# Altium project PCB Potencia.PrjPcb
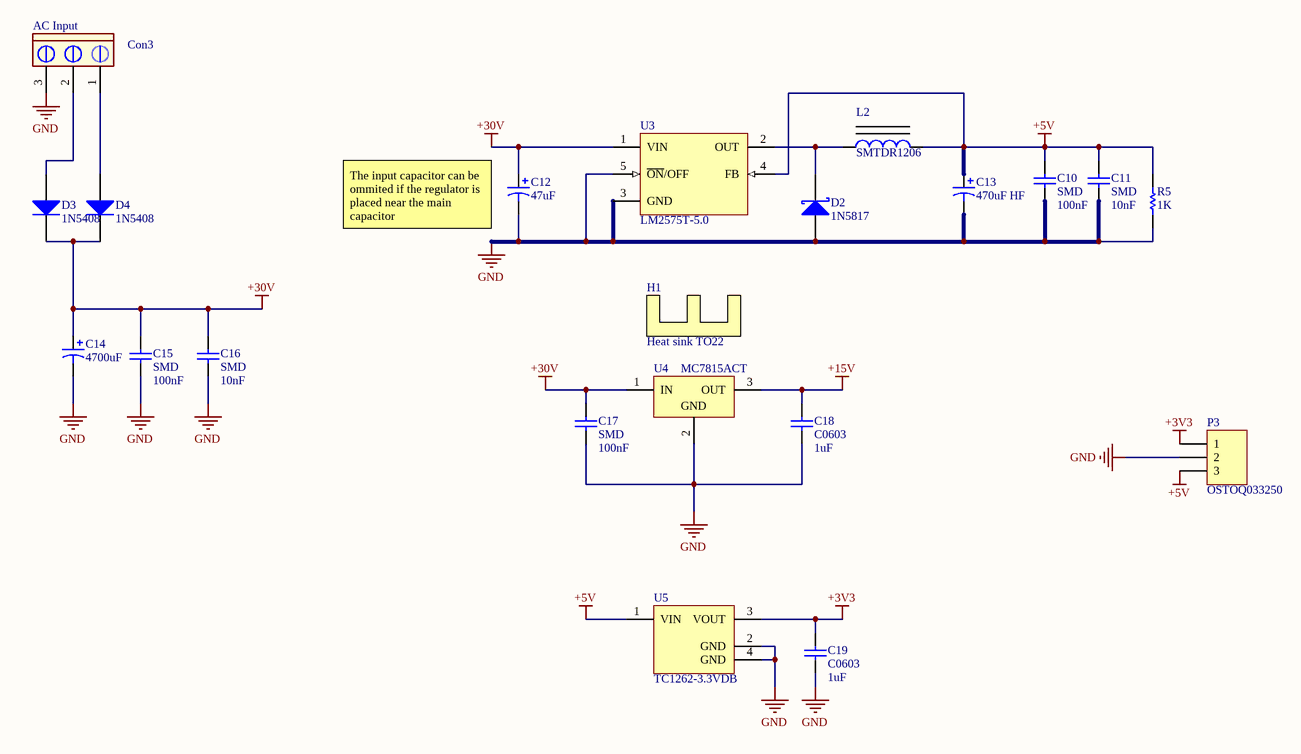
[diagram p0: Regulators.SchDoc]
5 sheets, 128 parts. Net scope: global (net labels, ports and power ports of the same name join across sheets).
Board file: Potencia.PcbDoc
Sheets:
  Regulators.SchDoc
  5V and 3V3 Outputs.SchDoc
  Variable Output 1.SchDoc
  Control.SchDoc
  Remote Feedback.SchDoc

## Sheet Regulators.SchDoc
size A4

### Parts
C10  SMD  value 100nF  [1206]
C11  SMD  value 10nF  [1206]
C12  47uF  [CAPPR2.5-6.3X11]
C13  470uF HF  [CAPPR5-10X20]
C14  value 4700uF  [Capacitor 23x48 (DxH)]  (hidden comment: Generic Electrolytic Capacitor)
C15  SMD  value 100nF  [1206]
C16  SMD  value 10nF  [1206]
C17  SMD  value 100nF  [1206]
C18  C0603  value 1uF  [0603]
C19  C0603  value 1uF  [0603]
Con3  AC Input  [My_CN3]
D2  1N5817  [DO-41]
D3  1N5408  [Vertical DO-201AD]
D4  1N5408  [Vertical DO-201AD]
H1  Heat sink TO22  [My_Heat_sink_TO22]
L2  SMTDR1206  [SMTDR1206 Inductor]
P3  XY2500R-F 3P  [OSTOQ033250]  (value not drawn)
R5  1K  [ERA-0603]
U3  LM2575T-5.0  [T05A]
U4  MC7815ACT  [221A-04]
U5  TC1262-3.3VDB  [SOT-223-DB3_N]

### Nets
+3V3: C19.2 P3.1 U5.3(VOUT)
+5V: C10.2 C11.2 C13.1 L2.2 P3.3 R5.2 U3.4(FB) U5.1(VIN)
+15V: C18.2 U4.3(OUT)
+30V: C12.1 C14.1 C15.2 C16.2 C17.2 D3.2(K) D4.2(K) U3.1(VIN) U4.1(IN)
GND: C10.1 C11.1 C12.2 C13.2 C14.2 C15.1 C16.1 C17.1 C18.1 C19.1 Con3.3 D2.1(A) P3.2 R5.1 U3.3(GND) U3.5(~{ON}/OFF) U4.2(GND) U5.2(GND) U5.4(GND)
NetCon3_1: Con3.1 D4.1(A)
NetCon3_2: Con3.2 D3.1(A)
NetD2_2: D2.2(K) L2.1 U3.2(OUT)

### Notes on the sheet
- (near C12) The input capacitor can be ommited if the regulator is placed near the main capacitor

### Library data of the parts
C10 C11 C15-C17 = C1206: Ceramic Chip Capacitor - Standard; Published: 17-Jul-2002; LatestRevisionDate: 19-Mar-2004; LatestRevisionNote: Silkscreen size reduced.; DatasheetDocument: Mar-2001; PackageDocument: Mar-2001; PackageReference: 1206; Publisher: Altium Limited; Code_JEITA: 1206; Code_IPC: 3216 [1206]; ComponentLink1Description: Manufacturer Link; ComponentLink1URL: http://www.kemet.com/; ComponentLink2Description: Datasheet; ComponentLink2URL: http://www.kemet.com/kemet/web/homepage/kechome.nsf/vapubfilesname/F3102TA.pdf/$file/F3102TA.pdf
C12 = EKE00BA247H00: Aluminum Electrolytic Capacitor, Radial Style with Long Leads: 47uF, 50V; Note: Refer to Manufacturer's Data Sheets for other lead formations; DrillSize: Nominal, Rounded To The Nearest 0.1mm; Published: 19-Mar-2004; DatasheetDocument: 30-May-2000; PackageReference: CAPPR2.5-6.3X11; Publisher: Altium Limited; ComponentLink1Description: Manufacturer Link; ComponentLink1URL: http://www.vishay.com/; ComponentLink2Description: Datasheet; ComponentLink2URL: http://www.vishay.com/docs/25008/eke.pdf; Value: 47uF
C13 = EKC00DE347E00: Aluminum Electrolytic Capacitor, Radial Style with Long Leads: 470uF, 25V; Note: Refer to Manufacturer's Data Sheets for other lead formations; DrillSize: Nominal, Rounded To The Nearest 0.1mm; Published: 19-Mar-2004; DatasheetDocument: 12-Jan-2000; PackageReference: CAPPR5-10X20; Publisher: Altium Limited; ComponentLink1Description: Manufacturer Link; ComponentLink1URL: http://www.vishay.com/; ComponentLink2Description: Datasheet; ComponentLink2URL: http://www.vishay.com/docs/25009/ekc.pdf; Value: 470uF
C18 C19 = C0603: C1608X7R1C105K X7R; Note: Footprint corresponds to dimensions for bulk cassette packaging. This case size has tightened tolerances.; Published: 17-Jul-2002; LatestRevisionDate: 19-Mar-2004; LatestRevisionNote: Silkscreen size reduced.; DatasheetDocument: Mar-2001; PackageDocument: Mar-2001; PackageReference: 0603; Publisher: Altium Limited; Code_JEITA: 0603; Code_IPC: 1608 [0603]; ComponentLink1Description: Manufacturer Link; ComponentLink1URL: http://www.kemet.com/; ComponentLink2Description: Datasheet; ComponentLink2URL: http://www.kemet.com/kemet/web/homepage/kechome.nsf/vapubfilesname/F3102TA.pdf/$file/F3102TA.pdf
Con3 = CON3 pin Green: Connector green screw
D2 = 1N6095: Schottky Rectifier; Note: No PCB Footprint Available; Published: 8-Jun-2000; LatestRevisionDate: 17-Jul-2002; LatestRevisionNote: Re-released for DXP Platform.; DatasheetVersion: Dec-1997; PackageReference: DO-203AA; Publisher: Altium Limited; ComponentLink1Description: Manufacturer Link; ComponentLink1URL: http://www.irf.com/; ComponentLink2Description: Datasheet; ComponentLink2URL: http://www.irf.com/product-info/datasheets/data/1n6096.pdf
D3 D4 = Diode 1N5408: 3 Amp Medium Power Silicon Rectifier Diode; Published: 8-Jun-2000; LatestRevisionDate: 17-Jul-2002; LatestRevisionNote: Re-released for DXP Platform.; DatasheetVersion: Aug-1984; PackageReference: DO-201AD; Publisher: Altium Limited; PackageDescription: Diode, Axial; Body 9.5 x 5.3 mm (LxDia. max), Lead Dia. 1.32 mm (max); ComponentLink1Description: Manufacturer Link; ComponentLink1URL: http://www.irf.com/
H1 = Heat sink TO22: Heat sink for TO22
L2 = Ferrite Inductor: Value: 100uH
P3 = XY2500R-F 3P: HEADER 3P P/CI 90gra VERDE P=3.81MM XY2500R-F; Manufacturer: On Shore Technology Inc.; Material Flammability Rating: UL94 V-0; Voltage - UL: 300V; Current - UL: 10A; Pitch: 0.150" (3.81mm); Number of Levels: 1; Positions Per Level: 3; Header Orientation: Vertical; Contact Tail Length: 0.138" (3.50mm); Supplier 1: Digi-Key; Manufacturer Part Number: OSTOQ033250; Wire Strip Length: -; Termination Style: Solder; Mounting Type: Through Hole; Supplier: Digi-Key; Category: Connectors, Interconnects; Supplier Part Number: ED2820-ND; Voltage - IEC: -; Operating Temperature: -30°C ~ 105°C; Color: Green; Features: -; Ingress Protection: -; Wire Gauge or Range - mm²: -; Insulation Height: 0.362" (9.20mm); Wire Gauge or Range - AWG: -; Plug Wire Entry: -; Screw Size: -; Contact Mating Finish: Tin; Torque - Screw: -; Housing Material: Thermoplastic; Current - IEC: -; Contact Material: Brass; RoHS: RoHS Compliant; Part Status: Active; Packaging: Bulk; Type: Header, Male Pins, Shrouded (4 Side); Number of Positions: 3
R5 = ERA3Y: Rectangular Thick Film Chip Resistor, 10 Ohm to 330k Ohm Range, 0.1% and 0.5% Tolerance, 0603 Size, 0.063 W; Note: If flow soldering, adjust pad width of PCB Footprint to 0.7 - 0.8 times the width of the resistor.; Published: 17-Dec-2003; LatestRevisionDate: 19-Mar-2004; LatestRevisionNote: Silkscreen size reduced.; PackageDocument: Mar-2003; PackageReference: ERA-0603; Publisher: Altium Limited; Code_IPC: 1608 [0603]; ComponentLink1Description: Manufacturer Link; ComponentLink1URL: http://www.panasonic.com/industrial/components/resistive_products.htm; ComponentLink2Description: Datasheet; ComponentLink2URL: http://www.panasonic.com/industrial/components/pdf/AOA0000CE8.pdf
U3 = LM2575T-5.0: SIMPLE SWITCHER® 1A Step-Down Voltage Regulator, 5-pin TO-220; Manufacturer: National Semiconductor; PackageTopMarking: NSUZXYTTE#*LM2575T*-5.0 P+; PowerWise: N; High-Reliability: Y; DatasheetVersion: Apr-2007; PackageVersion: revJ, Jan-1992; PackageReference: T05A; PackageDescription: TO-220, Molded, 5 Lead, Straight; PartNumber: LM2575T-5.0; RoHS: N; PinCount: 5; CompType: Switcher; Code_JEDEC: TO-220-AB; ComponentLink1Description: Manufacturer URL; ComponentLink1URL: http://www.national.com/; ComponentLink2Description: LM2575 Datasheet; ComponentLink2URL: http://www.national.com/ds/LM/LM2575.pdf; ComponentLink3Description: LM2575 Web Page; ComponentLink3URL: http://www.national.com/pf/LM/LM2575.html; ComponentLink4Description: T05A Package Page; ComponentLink4URL: http://www.national.com/packaging/folders/t05a.html
U4 = MC7815ACT: 3-Terminal Positive Fixed Voltage Regulator; Note: Pin 2 is electrically connected to TAB; Published: 17-Jul-2002; DatasheetVersion: 1988; PackageReference: 221A-04; Publisher: Altium Limited; PackageDescription: TO, Thru-Hole, Vertical, Heatsink Mounted; 3 In-Line Leads; Pitch 2.54 mm; Code_JEDEC: TO-262-AA; ComponentLink1Description: Manufacturer Link; ComponentLink1URL: http://www.onsemi.com/site/products/taxonomy/0,4438,503,00.html; ComponentLink2Description: Datasheet; ComponentLink2URL: http://www.onsemi.com/pub/Collateral/MC7800-D.PDF
U5 = TC1262-3.3VDB: 500mA Fixed Output CMOS LDO, 3-Pin SOT-223, Extended Temperature; Manufacturer: Microchip; DatasheetVersion: revB, 2002; PackageVersion: revBB, Aug-2009; PackageReference: SOT-223-DB3; PackageDescription: 3-Lead Plastic Small Outline Transistor (DB) [SOT-223]; Supplier 1: Digi-Key; Supplier Part Number 1: TC1262-3.3VDB-ND; Supplier 2: Farnell; Supplier Part Number 2: 1852183; Supplier 3: Newark; Supplier Part Number 3: 53R0370; Supplier 4: Mouser; Supplier Part Number 4: 579-TC1262-3.3VDB; Mounting Technology: Surface Mount; PartNumber: TC1262-3.3VDB; ComponentLink1Description: Manufacturer URL; ComponentLink1URL: http://www.microchip.com/; ComponentLink2Description: Datasheet; ComponentLink2URL: http://ww1.microchip.com/downloads/en/DeviceDoc/21373b.pdf; ComponentLink3Description: Package Specification; ComponentLink3URL: http://www.microchip.com/stellent/groups/techpub_sg/documents/packagingspec/en012702.pdf

## Sheet 5V and 3V3 Outputs.SchDoc
size A4
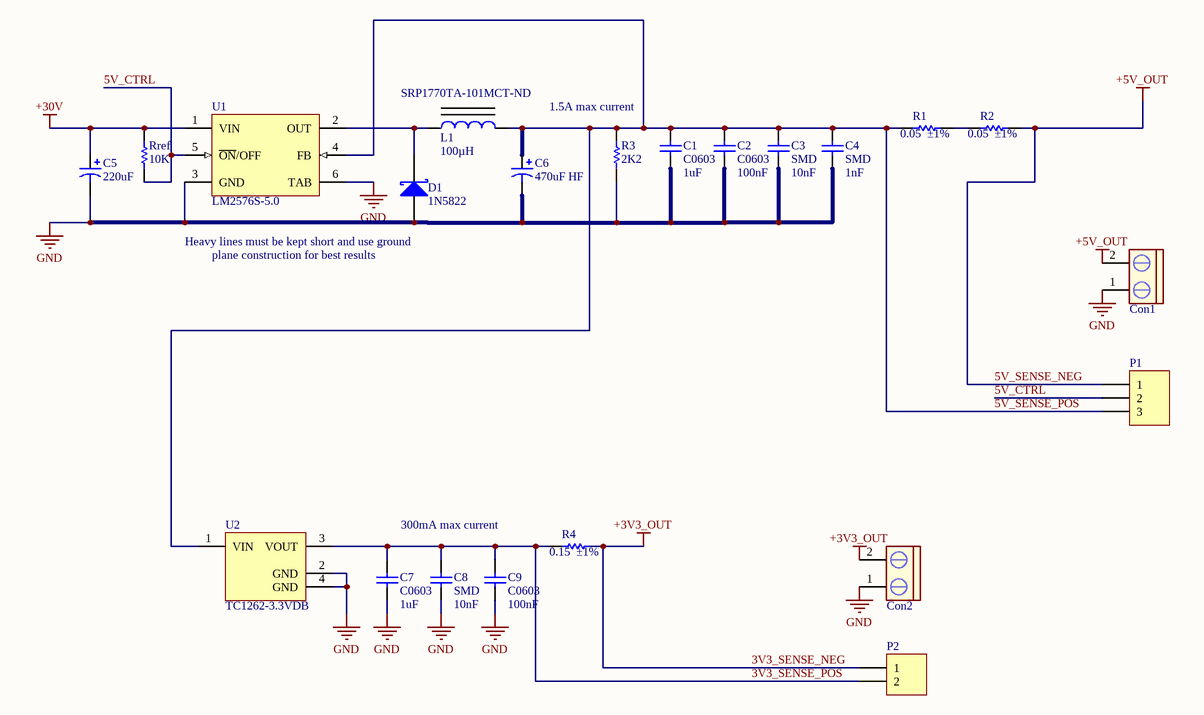
[diagram p1: 5V and 3V3 Outputs.SchDoc]

### Parts
C1  C0603  value 1uF  [0603]
C2  C0603  value 100nF  [0603]
C3  SMD  value 10nF  [1206]
C4  SMD  value 1nF  [1206]
C5  220uF  [CAPPR5-10X16]
C6  470uF HF  [CAPPR5-10X20]
C7  C0603  value 1uF  [0603]
C8  SMD  value 10nF  [1206]
C9  C0603  value 100nF  [0603]
Con1  Salida Buck  [My_CN2]  (value not drawn)
Con2  Salida Buck  [My_CN2]  (value not drawn)
D1  1N5822  [Vertical DO-201AD 10.5mm]
L1  Supplier Part Number: SRP1770TA-101MCT-ND  Inductance: 100µH  [SRP1770TA Series]  (hidden comment: Ferrite Inductor)
P1  Header 3  [My_1X03]  (value not drawn)
P2  Header 2  [My_1X02]  (value not drawn)
R1  Resistance (Ohms): 0.05  Tolerance: ±1%  [L1W-2512]  (hidden comment: ERJL1W)
R2  Resistance (Ohms): 0.05  Tolerance: ±1%  [L1W-2512]  (hidden comment: ERJL1W)
R3  2K2  [ERA-0603]
R4  Resistance (Ohms): 0.15  Tolerance: ±1%  [8RB-1206]  (hidden comment: SMD)
Rref  10K  [ERA-0603]
U1  LM2576S-5.0  [TS5B_N]
U2  TC1262-3.3VDB  [SOT-223-DB3_N]

### Nets
3V3_SENSE_NEG: Con2.2 P2.1 R4.2  [also labelled +3V3_OUT]
5V_SENSE_NEG: Con1.2 P1.1 R2.2  [also labelled +5V_OUT]
+30V: C5.1 Rref.2 U1.1(VIN)
GND: C1.1 C2.1 C3.1 C4.1 C5.2 C6.2 C7.1 C8.1 C9.1 Con1.1 Con2.1 D1.1(A) R3.1 U1.3(GND) U1.6(TAB) U2.2(GND) U2.4(GND)
3V3_SENSE_POS: C7.2 C8.2 C9.2 P2.2 R4.1 U2.3(VOUT)
5V_CTRL: P1.2 Rref.1 U1.5(~{ON}/OFF)
5V_SENSE_POS: C1.2 C2.2 C3.2 C4.2 C6.1 L1.2 P1.3 R1.1 R3.2 U1.4(FB) U2.1(VIN)
NetD1_2: D1.2(K) L1.1 U1.2(OUT)
NetR1_2: R1.2 R2.1

### Notes on the sheet
- 1.5A max current
- Heavy lines must be kept short and use ground
- plane construction for best results
- 300mA max current

### Library data of the parts
C1 C2 C7 C9 = C0603: as C18 on sheet Regulators; Published: 17-Jul-2002; LatestRevisionDate: 19-Mar-2004; LatestRevisionNote: Silkscreen size reduced.; DatasheetDocument: Mar-2001; PackageDocument: Mar-2001; PackageReference: 0603; Publisher: Altium Limited; Code_JEITA: 0603; Code_IPC: 1608 [0603]; ComponentLink1Description: Manufacturer Link; ComponentLink1URL: http://www.kemet.com/; ComponentLink2Description: Datasheet; ComponentLink2URL: http://www.kemet.com/kemet/web/homepage/kechome.nsf/vapubfilesname/F3102TA.pdf/$file/F3102TA.pdf
C3 C4 C8 = C1206: Ceramic Chip Capacitor - Standard; Published: 17-Jul-2002; LatestRevisionDate: 19-Mar-2004; LatestRevisionNote: Silkscreen size reduced.; DatasheetDocument: Mar-2001; PackageDocument: Mar-2001; PackageReference: 1206; Publisher: Altium Limited; Code_JEITA: 1206; Code_IPC: 3216 [1206]; ComponentLink1Description: Manufacturer Link; ComponentLink1URL: http://www.kemet.com/; ComponentLink2Description: Datasheet; ComponentLink2URL: http://www.kemet.com/kemet/web/homepage/kechome.nsf/vapubfilesname/F3102TA.pdf/$file/F3102TA.pdf
C5 = EKA00DD322J00: Aluminum Electrolytic Capacitor, Radial Style with Long Leads: 220uF, 63V; Note: Refer to Manufacturer's Data Sheets for other lead formations; DrillSize: Nominal, Rounded To The Nearest 0.1mm; Published: 19-Mar-2004; DatasheetDocument: 20-Feb-2001; PackageReference: CAPPR5-10X16; Publisher: Altium Limited; ComponentLink1Description: Manufacturer Link; ComponentLink1URL: http://www.vishay.com/; ComponentLink2Description: Datasheet; ComponentLink2URL: http://www.vishay.com/docs/25014/eka.pdf; Value: 220uF
C6 = EKC00DE347E00: as C13 on sheet Regulators; Published: 19-Mar-2004; DatasheetDocument: 12-Jan-2000; PackageReference: CAPPR5-10X20; Publisher: Altium Limited; ComponentLink1Description: Manufacturer Link; ComponentLink1URL: http://www.vishay.com/; ComponentLink2Description: Datasheet; ComponentLink2URL: http://www.vishay.com/docs/25009/ekc.pdf; Value: 470uF
Con1 Con2 = CON2 pin blue: Connector blue screw
D1 = Generic Schottky Diode
L1 = Ferrite Inductor: Manufacturer Part Number: SRP1770TA-101M; Manufacturer: Bourns Inc.; Value: 100uH; Tolerance: ±20%; Type: Wirewound; DC Resistance (DCR): 118 mOhm Max; Current Rating: 5.3A; Current - Saturation: 6.5A; Shielding: Shielded; Material - Core: Carbonyl Powder; Frequency - Self Resonant: 2MHz; Q @ Freq: 20 @ 100kHz; Supplier Device Package: -; Package / Case: Nonstandard; Operating Temperature: -40°C ~ 150°C; Mounting Type: Surface Mount; Height - Seated (Max): 0.276" (7.00mm); Size / Dimension: 0.666" L x 0.666" W (16.90mm x 16.90mm); Part Status: Active; Ratings: AEC-Q200; Category: Inductors, Coils, Chokes; Packaging: Cut Tape (CT); RoHS: RoHS Compliant; Supplier: Digi-Key
P1 = Header 3: Header, 3-Pin; LatestRevisionDate: 17-Jul-2002; LatestRevisionNote: Re-released for DXP Platform.; Publisher: Altium Limited
P2 = Header 2: Header, 2-Pin; LatestRevisionDate: 17-Jul-2002; LatestRevisionNote: Re-released for DXP Platform.; Publisher: Altium Limited
R1 R2 = ERJL1W: Low Ohmic Value Thick Film Chip Resistor, 40m Ohm to 100m Ohm Range, 1% and 5% Tolerance, 2512 Size, 1 W; Manufacturer Part Number: PE2512FKE070R05L; Manufacturer: Yageo; Power (Watts): 1W; Temperature Coefficient: ±50ppm/°C; Published: 17-Dec-2003; LatestRevisionDate: 19-Mar-2004; LatestRevisionNote: Silkscreen size reduced.; PackageDocument: Mar-2003; PackageReference: L1W-2512; Publisher: Altium Limited; ComponentLink1Description: Manufacturer Link; ComponentLink1URL: http://www.panasonic.com/industrial/components/resistive_products.htm; ComponentLink2Description: Datasheet; ComponentLink2URL: http://www.panasonic.com/industrial/components/pdf/AOA0000CE3.pdf; Features: Automotive AEC-Q200, Current Sense, Moisture Resistant; Supplier: Digi-Key; Package / Case: 2512 (6432 Metric); RoHS: RoHS Compliant; Height - Seated (Max): 0.035" (0.89mm); Size / Dimension: 0.250" L x 0.125" W (6.35mm x 3.18mm); Supplier Device Package: 2512; Part Status: Active; Packaging: Cut Tape (CT); Operating Temperature: -55°C ~ 170°C; Composition: Metal Film; Category: Resistors; Failure Rate: -; Supplier Part Number: YAG2156CT-ND
R3 Rref = ERA3Y: as R5 on sheet Regulators; Published: 17-Dec-2003; LatestRevisionDate: 19-Mar-2004; LatestRevisionNote: Silkscreen size reduced.; PackageDocument: Mar-2003; PackageReference: ERA-0603; Publisher: Altium Limited; Code_IPC: 1608 [0603]; ComponentLink1Description: Manufacturer Link; ComponentLink1URL: http://www.panasonic.com/industrial/components/resistive_products.htm; ComponentLink2Description: Datasheet; ComponentLink2URL: http://www.panasonic.com/industrial/components/pdf/AOA0000CE8.pdf
R4 = ERJ8BQ: Low Ohmic Value Thick Film Chip Resistor, 0.22 Ohm to 9.1 Ohm Range, 1%, 2% and 5% Tolerance, 1206 Size, 0.33 W; Manufacturer Part Number: KRL1632E-M-R150-F-T5; Manufacturer: Susumu; Power (Watts): 0.75W, 3/4W; Temperature Coefficient: ±50ppm/°C; Features: Automotive AEC-Q200, Current Sense; Failure Rate: -; RoHS: RoHS Compliant; Supplier Device Package: 1206; Category: Resistors; Packaging: Tape & Reel (TR); Height - Seated (Max): 0.028" (0.70mm); Supplier Part Number: 408-1584-2-ND; Operating Temperature: -55°C ~ 155°C; Composition: Metal Foil; Supplier: Digi-Key; Part Status: Active; Size / Dimension: 0.126" L x 0.063" W (3.20mm x 1.60mm); Package / Case: 1206 (3216 Metric)
U1 = LM2576S-5.0: SIMPLE SWITCHER® 3A Step-Down Voltage Regulator, 5-pin TO-263; Manufacturer: National Semiconductor; PackageTopMarking: NSUZXYTTE#*LM2576S*-5.0 P+; PowerWise: N; High-Reliability: Y; DatasheetVersion: Aug-2004; PackageVersion: revD, Apr-2005; PackageReference: TS5B; PackageDescription: TO-263, Molded, .400 x .390 x .180in, 5 Lead, .067in Pitch, Surface Mount; PartNumber: LM2576S-5.0; RoHS: N; PinCount: 5; CompType: Switcher; Code_JEDEC: MO-169-AB; ComponentLink1Description: Manufacturer URL; ComponentLink1URL: http://www.national.com/; ComponentLink2Description: LM2576 Datasheet; ComponentLink2URL: http://www.national.com/ds/LM/LM2576.pdf; ComponentLink3Description: LM2576 Web Page; ComponentLink3URL: http://www.national.com/pf/LM/LM2576.html; ComponentLink4Description: TS5B Package Page; ComponentLink4URL: http://www.national.com/packaging/folders/ts5b.html
U2 = TC1262-3.3VDB: as U5 on sheet Regulators; DatasheetVersion: revB, 2002; PackageVersion: revBB, Aug-2009; PackageReference: SOT-223-DB3; PackageDescription: 3-Lead Plastic Small Outline Transistor (DB) [SOT-223]; Supplier 1: Digi-Key; Supplier Part Number 1: TC1262-3.3VDB-ND; Supplier 2: Farnell; Supplier Part Number 2: 1852183; Supplier 3: Newark; Supplier Part Number 3: 53R0370; Supplier 4: Mouser; Supplier Part Number 4: 579-TC1262-3.3VDB; Mounting Technology: Surface Mount; PartNumber: TC1262-3.3VDB; ComponentLink1Description: Manufacturer URL; ComponentLink1URL: http://www.microchip.com/; ComponentLink2Description: Datasheet; ComponentLink2URL: http://ww1.microchip.com/downloads/en/DeviceDoc/21373b.pdf; ComponentLink3Description: Package Specification; ComponentLink3URL: http://www.microchip.com/stellent/groups/techpub_sg/documents/packagingspec/en012702.pdf

## Sheet Variable Output 1.SchDoc
size A4
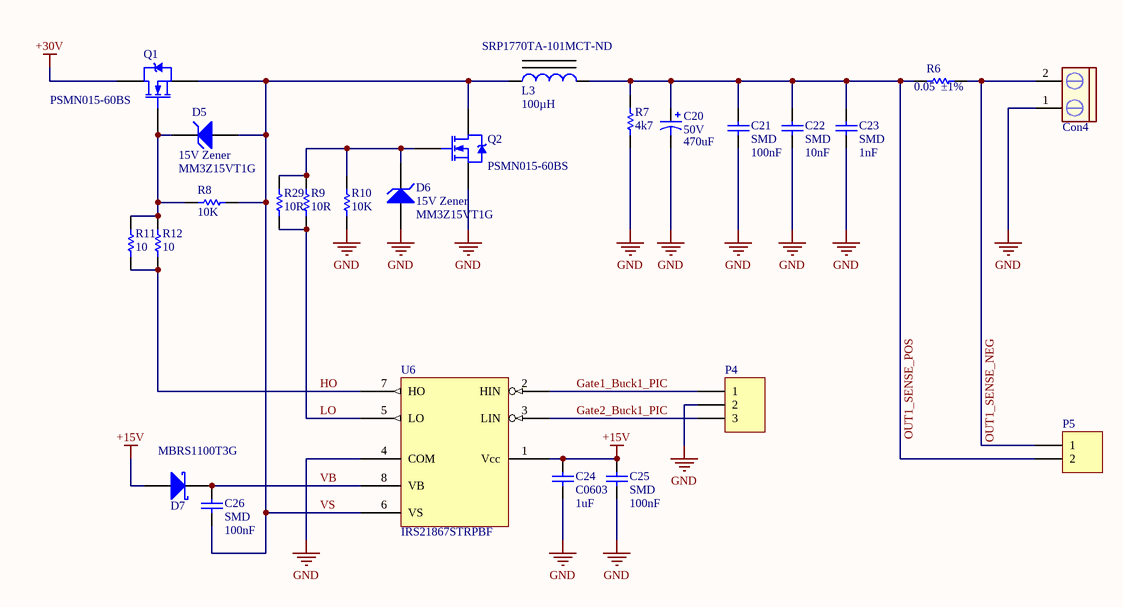
[diagram p2: Variable Output 1.SchDoc]

### Parts
C20  50V  value 470uF  [CAPPR5-10X20]
C21  SMD  value 100nF  [1206]
C22  SMD  value 10nF  [1206]
C23  SMD  value 1nF  [1206]
C24  C0603  value 1uF  [0603]
C25  SMD  value 100nF  [1206]
C26  SMD  value 100nF  [1206]
Con4  Salida Buck  [My_CN2]  (value not drawn)
D5  15V Zener  Manufacturer Part Number: MM3Z15VT1G  [SOD323]
D6  15V Zener  Manufacturer Part Number: MM3Z15VT1G  [SOD323]
D7  MBRS1100T3G  [SMB]
L3  Supplier Part Number: SRP1770TA-101MCT-ND  Inductance: 100µH  [SRP1770TA Series]  (hidden comment: Ferrite Inductor)
P4  Header 3  [My_1X03]  (value not drawn)
P5  Header 2  [My_1X02]  (value not drawn)
Q1  Manufacturer Part Number: PSMN015-60BS  [D2PAK_N]  (hidden comment: SUM110P06)
Q2  Manufacturer Part Number: PSMN015-60BS  [D2PAK_N]  (hidden comment: SUM110P06)
R6  Resistance (Ohms): 0.05  Tolerance: ±1%  [L1W-2512]  (hidden comment: ERJL1W)
R7  value 4k7  [8RB-1206]  (hidden comment: SMD)
R8  10K  [ERA-0603]
R9  10R  [ERA-0603]
R10  10K  [ERA-0603]
R11  10  [ERA-0603]
R12  10  [ERA-0603]
R29  10R  [ERA-0603]
U6  Manufacturer Part Number: IRS21867STRPBF  [SOIC8]  (hidden comment: IRS21867S)

### Nets
+15V: C24.2 C25.2 D7.1(A) U6.1(Vcc)
+30V: Q1.2(D)
GND: C20.2 C21.1 C22.1 C23.1 C24.1 C25.1 Con4.1 D6.1(A) P4.2 Q2.3(S) R7.1 R10.1 U6.4(COM)
Gate1_Buck1_PIC: P4.1 U6.2(HIN)
Gate2_Buck1_PIC: P4.3 U6.3(LIN)
HO: R11.1 R12.1 U6.7(HO)
LO: R9.1 R29.1 U6.5(LO)
OUT1_SENSE_NEG: Con4.2 P5.1 R6.2
OUT1_SENSE_POS: C20.1 C21.2 C22.2 C23.2 L3.2 P5.2 R6.1 R7.2
VB: C26.2 D7.2(K) U6.8(VB)
VS: C26.1 D5.1(A) L3.1 Q1.3(S) Q2.2(D) R8.2 U6.6(VS)
NetD5_2: D5.2(K) Q1.1(G) R8.1 R11.2 R12.2
NetD6_2: D6.2(K) Q2.1(G) R9.2 R10.2 R29.2

### Library data of the parts
C20 = EKB00DE347H00: Aluminum Electrolytic Capacitor, Radial Style with Long Leads: 470uF, 50V; Note: Refer to Manufacturer's Data Sheets for other lead formations; DrillSize: Nominal, Rounded To The Nearest 0.1mm; Published: 19-Mar-2004; DatasheetDocument: 21-Feb-2001; PackageReference: CAPPR5-10X20; Publisher: Altium Limited; ComponentLink1Description: Manufacturer Link; ComponentLink1URL: http://www.vishay.com/; ComponentLink2Description: Datasheet; ComponentLink2URL: http://www.vishay.com/docs/25013/ekb.pdf
C21-C23 C25 C26 = C1206: Ceramic Chip Capacitor - Standard; Published: 17-Jul-2002; LatestRevisionDate: 19-Mar-2004; LatestRevisionNote: Silkscreen size reduced.; DatasheetDocument: Mar-2001; PackageDocument: Mar-2001; PackageReference: 1206; Publisher: Altium Limited; Code_JEITA: 1206; Code_IPC: 3216 [1206]; ComponentLink1Description: Manufacturer Link; ComponentLink1URL: http://www.kemet.com/; ComponentLink2Description: Datasheet; ComponentLink2URL: http://www.kemet.com/kemet/web/homepage/kechome.nsf/vapubfilesname/F3102TA.pdf/$file/F3102TA.pdf
C24 = C0603: as C18 on sheet Regulators; Published: 17-Jul-2002; LatestRevisionDate: 19-Mar-2004; LatestRevisionNote: Silkscreen size reduced.; DatasheetDocument: Mar-2001; PackageDocument: Mar-2001; PackageReference: 0603; Publisher: Altium Limited; Code_JEITA: 0603; Code_IPC: 1608 [0603]; ComponentLink1Description: Manufacturer Link; ComponentLink1URL: http://www.kemet.com/; ComponentLink2Description: Datasheet; ComponentLink2URL: http://www.kemet.com/kemet/web/homepage/kechome.nsf/vapubfilesname/F3102TA.pdf/$file/F3102TA.pdf
Con4 = CON2 pin blue: Connector blue screw
D5 D6 = D Zener: Zener Diode; Manufacturer: ON Semiconductor; Current - Reverse Leakage @ Vr: 50nA @ 10.5V; Voltage - Forward (Vf) (Max) @ If: 900mV @ 10mA; Tolerance: ±5%; Power - Max: 300mW; Packaging: Cut Tape (CT); Operating Temperature: -65°C ~ 150°C; Supplier Device Package: SOD-323; Mounting Type: Surface Mount; Supplier: Digi-Key; Supplier Part Number: MM3Z15VT1GOSCT-ND; RoHS: RoHS Compliant; Package / Case: SC-76, SOD-323; Category: Discrete Semiconductor Products; Part Status: Active
D7 = Generic Schottky Diode
L3 = Ferrite Inductor: as L1 on sheet 5V and 3V3 Outputs; Supplier Device Package: -; Package / Case: Nonstandard; Operating Temperature: -40°C ~ 150°C; Mounting Type: Surface Mount; Height - Seated (Max): 0.276" (7.00mm); Size / Dimension: 0.666" L x 0.666" W (16.90mm x 16.90mm); Part Status: Active; Ratings: AEC-Q200; Category: Inductors, Coils, Chokes; Packaging: Cut Tape (CT); RoHS: RoHS Compliant; Supplier: Digi-Key
P4 = Header 3: Header, 3-Pin; LatestRevisionDate: 17-Jul-2002; LatestRevisionNote: Re-released for DXP Platform.; Publisher: Altium Limited
P5 = Header 2: Header, 2-Pin; LatestRevisionDate: 17-Jul-2002; LatestRevisionNote: Re-released for DXP Platform.; Publisher: Altium Limited
Q1 Q2 = IRF540NS: HEXFET Power MOSFET; Manufacturer: Vishay Siliconix; Vgs (Max): ±20V; Rds On (Max) @ Id, Vgs: 6.9 mOhm @ 30A, 10V; Vgs(th) (Max) @ Id: 3V @ 250µA; Power Dissipation (Max): 3.75W (Ta), 375W (Tc); Input Capacitance (Ciss) (Max) @ Vds: 11400pF @ 25V; Gate Charge (Qg) (Max) @ Vgs: 345nC @ 10V; Current - Continuous Drain (Id) @ 25°C: 110A (Tc); Drive Voltage (Max Rds On,  Min Rds On): 4.5V, 10V; FET Type: P-Channel; Drain to Source Voltage (Vdss): 60V; Supplier Device Package: TO-263 (D2Pak); FET Feature: -; Mounting Type: Surface Mount; Package / Case: TO-263-3, D²Pak (2 Leads + Tab), TO-263AB; Operating Temperature: -55°C ~ 175°C (TJ); Supplier: Digi-Key; Packaging: Cut Tape (CT); Category: Discrete Semiconductor Products; RoHS: RoHS Compliant; Technology: MOSFET (Metal Oxide); Part Status: Active; Supplier Part Number: SUM110P06-07L-E3CT-ND
R6 = ERJL1W: as R1 on sheet 5V and 3V3 Outputs; Published: 17-Dec-2003; LatestRevisionDate: 19-Mar-2004; LatestRevisionNote: Silkscreen size reduced.; PackageDocument: Mar-2003; PackageReference: L1W-2512; Publisher: Altium Limited; ComponentLink1Description: Manufacturer Link; ComponentLink1URL: http://www.panasonic.com/industrial/components/resistive_products.htm; ComponentLink2Description: Datasheet; ComponentLink2URL: http://www.panasonic.com/industrial/components/pdf/AOA0000CE3.pdf; Features: Automotive AEC-Q200, Current Sense, Moisture Resistant; Supplier: Digi-Key; Package / Case: 2512 (6432 Metric); RoHS: RoHS Compliant; Height - Seated (Max): 0.035" (0.89mm); Size / Dimension: 0.250" L x 0.125" W (6.35mm x 3.18mm); Supplier Device Package: 2512; Part Status: Active; Packaging: Cut Tape (CT); Operating Temperature: -55°C ~ 170°C; Composition: Metal Film; Category: Resistors; Failure Rate: -; Supplier Part Number: YAG2156CT-ND
R7 = ERJ8BQ: Low Ohmic Value Thick Film Chip Resistor, 0.22 Ohm to 9.1 Ohm Range, 1%, 2% and 5% Tolerance, 1206 Size, 0.33 W; Published: 17-Dec-2003; LatestRevisionDate: 19-Mar-2004; LatestRevisionNote: Silkscreen size reduced.; PackageDocument: Mar-2003; PackageReference: 8RB-1206; Publisher: Altium Limited; Code_IPC: 3216 [1206]; ComponentLink1Description: Manufacturer Link; ComponentLink1URL: http://www.panasonic.com/industrial/components/resistive_products.htm; ComponentLink2Description: Datasheet; ComponentLink2URL: http://www.panasonic.com/industrial/components/pdf/AOA0000CE3.pdf
R8-R12 R29 = ERA3Y: as R5 on sheet Regulators; Published: 17-Dec-2003; LatestRevisionDate: 19-Mar-2004; LatestRevisionNote: Silkscreen size reduced.; PackageDocument: Mar-2003; PackageReference: ERA-0603; Publisher: Altium Limited; Code_IPC: 1608 [0603]; ComponentLink1Description: Manufacturer Link; ComponentLink1URL: http://www.panasonic.com/industrial/components/resistive_products.htm; ComponentLink2Description: Datasheet; ComponentLink2URL: http://www.panasonic.com/industrial/components/pdf/AOA0000CE8.pdf
U6 = IRS21867S: Half-Bridge Gate Driver IC Inverting 8-SOIC; Manufacturer: Infineon Technologies; Gate Type: IGBT, N-Channel MOSFET; Current - Peak Output (Source, Sink): 4A, 4A; Voltage - Supply: 10 V ~ 20 V; Rise / Fall Time (Typ): 22ns, 18ns; Channel Type: Independent; Logic Voltage - VIL, VIH: 0.8V, 2.5V; Part Status: Active; Supplier: Digi-Key; Supplier Device Package: 8-SOIC; Package / Case: 8-SOIC (0.154", 3.90mm Width); Mounting Type: Surface Mount; Operating Temperature: -40°C ~ 150°C (TJ); Packaging: Cut Tape (CT); Input Type: Inverting; Category: Integrated Circuits (ICs); RoHS: RoHS Compliant; Driven Configuration: Half-Bridge; Supplier Part Number: IRS21867STRPBFCT-ND

## Sheet Control.SchDoc
size A4
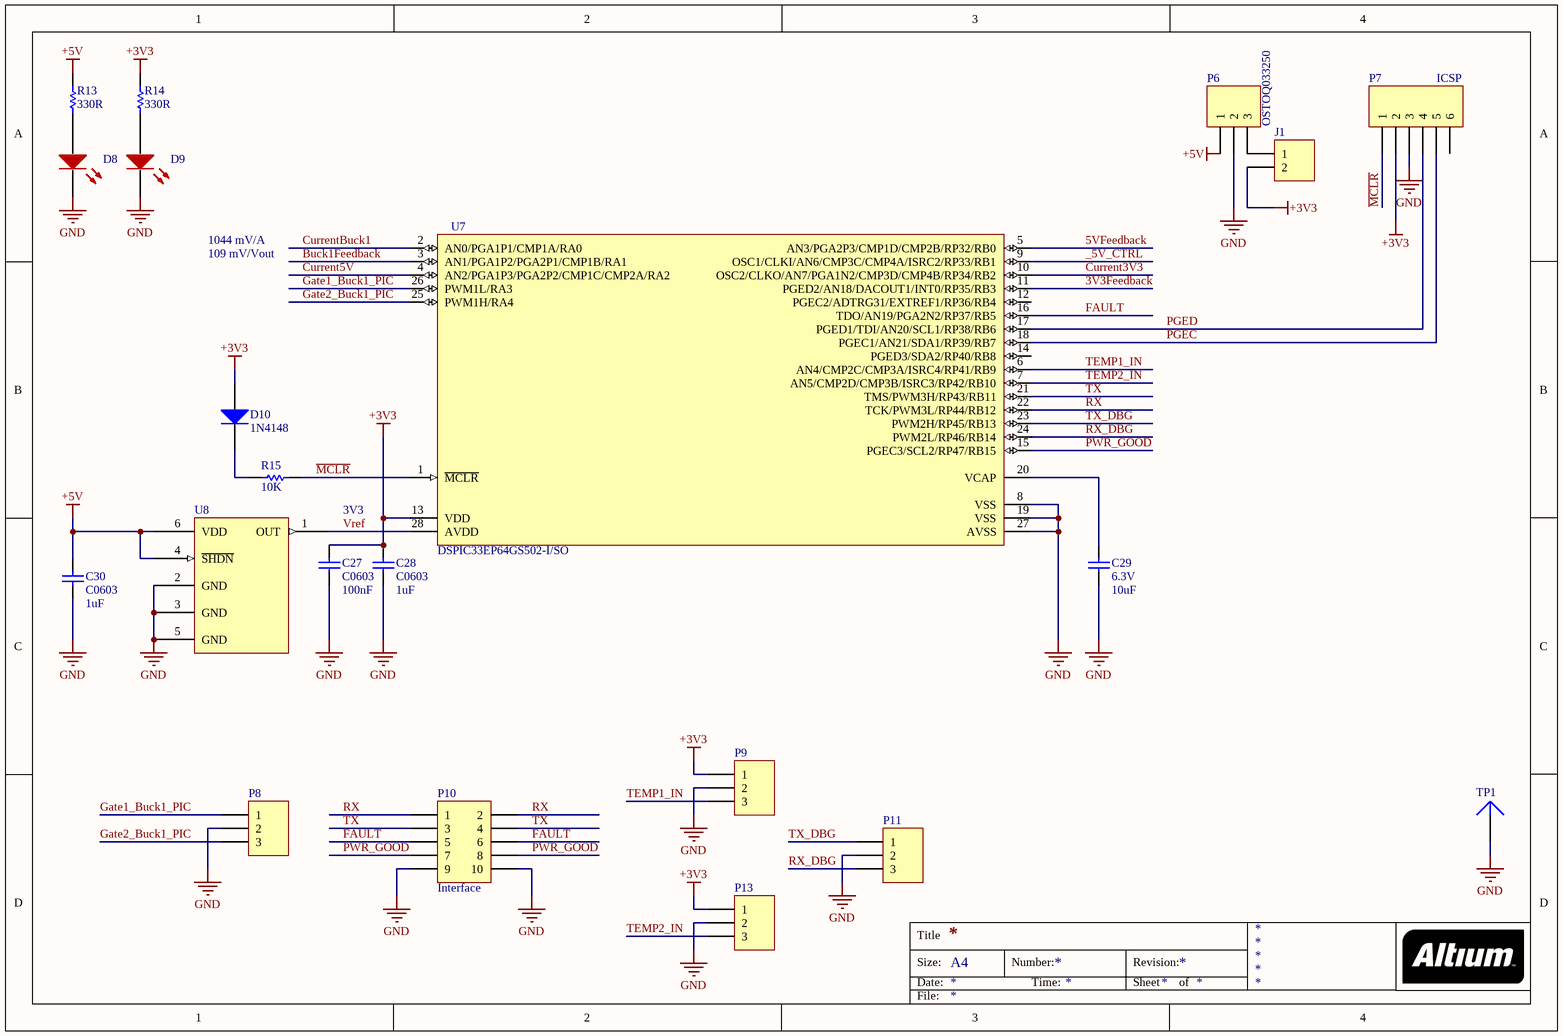
[diagram p3: Control.SchDoc]

### Parts
C27  C0603  value 100nF  [0603]
C28  C0603  value 1uF  [0603]
C29  6.3V  value 10uF  [C0805]
C30  C0603  value 1uF  [0603]
D8  15-21SURC/S530-A3/TR8  [15-21SURC/S530-A3/TR8]  (value not drawn)
D9  15-21SURC/S530-A3/TR8  [15-21SURC/S530-A3/TR8]  (value not drawn)
D10  1N4148  [SOD80C]
J1  Header 2  [My_1X02]  (value not drawn)
P6  XY2500R-F 3P  [OSTOQ033250]  (value not drawn)
P7  ICSP  [My_1X06]
P8  Header 3  [My_1X03]  (value not drawn)
P9  Header 3  [My_1X03]  (value not drawn)
P10  Interface  [HDR2X5]
P11  Header 3  [My_1X03]  (value not drawn)
P13  Header 3  [My_1X03]  (value not drawn)
R13  value 330R  [8RB-1206]  (hidden comment: SMD)
R14  value 330R  [8RB-1206]  (hidden comment: SMD)
R15  10K  [ERA-0603]
TP1  (no value)  [PIN1]
U7  Manufacturer Part Number: DSPIC33EP64GS502-I/SO  [MCHP-SOIC-SO28_N]  (hidden comment: DSPIC33EP64GS502)
U8  MCP1501T  [SOT-23-6]  (value not drawn)

### Nets
+3V3: C27.1 C28.1 D10.1(A) J1.2 P7.2 P9.1 P13.1 R14.1 U7.13(VDD)
+5V: C30.1 P6.1 R13.1 U8.4(~{SHDN}) U8.6(VDD)
GND: C27.2 C28.2 C29.1 C30.2 D8.2 D9.2 P6.2 P7.3 P8.2 P9.2 P10.9 P10.10 P11.2 P13.2 TP1.1 U7.8(VSS) U7.19(VSS) U7.27(AVSS) U8.2(GND) U8.3(GND) U8.5(GND)
3V3Feedback: U7.11(PGED2/AN18/DACOUT1/INT0/RP35/RB3)
5VFeedback: U7.5(AN3/PGA2P3/CMP1D/CMP2B/RP32/RB0)
_5V_CTRL: U7.9(OSC1/CLKI/AN6/CMP3C/CMP4A/ISRC2/RP33/RB1)
Buck1Feedback: U7.3(AN1/PGA1P2/PGA2P1/CMP1B/RA1)
Current3V3: U7.10(OSC2/CLKO/AN7/PGA1N2/CMP3D/CMP4B/RP34/RB2)
Current5V: U7.4(AN2/PGA1P3/PGA2P2/CMP1C/CMP2A/RA2)
CurrentBuck1: U7.2(AN0/PGA1P1/CMP1A/RA0)
FAULT: P10.5 P10.6 U7.16(TDO/AN19/PGA2N2/RP37/RB5)
Gate1_Buck1_PIC: P8.1 U7.26(PWM1L/RA3)
Gate2_Buck1_PIC: P8.3 U7.25(PWM1H/RA4)
~{MCLR}: P7.1 R15.1 U7.1(~{MCLR})
PGEC: P7.5 U7.18(PGEC1/AN21/SDA1/RP39/RB7)
PGED: P7.4 U7.17(PGED1/TDI/AN20/SCL1/RP38/RB6)
PWR_GOOD: P10.7 P10.8 U7.15(PGEC3/SCL2/RP47/RB15)
RX: P10.1 P10.2 U7.22(TCK/PWM3L/RP44/RB12)
RX_DBG: P11.3 U7.24(PWM2L/RP46/RB14)
TEMP1_IN: P9.3 U7.6(AN4/CMP2C/CMP3A/ISRC4/RP41/RB9)
TEMP2_IN: P13.3 U7.7(AN5/CMP2D/CMP3B/ISRC3/RP42/RB10)
TX: P10.3 P10.4 U7.21(TMS/PWM3H/RP43/RB11)
TX_DBG: P11.1 U7.23(PWM2H/RP45/RB13)
Vref: U7.28(AVDD) U8.1(OUT)
NetC29_2: C29.2 U7.20(VCAP)
NetD8_1: D8.1 R13.2
NetD9_1: D9.1 R14.2
NetD10_2: D10.2(K) R15.2
NetJ1_1: J1.1 P6.3

Not connected (* = marked no-connect by the designer): P7 6; U7 12(PGEC2/ADTRG31/EXTREF1/RP36/RB4) 14(PGED3/SDA2/RP40/RB8)

### Notes on the sheet
- 1044 mV/A
- 109 mV/Vout
- 3V3
- Title
- Size:
- Date:
- A4
- Number:
- Time:
- Revision:
- Sheet
- of
- File:

### Library data of the parts
C27 C28 C30 = C0603: as C18 on sheet Regulators; Published: 17-Jul-2002; LatestRevisionDate: 19-Mar-2004; LatestRevisionNote: Silkscreen size reduced.; DatasheetDocument: Mar-2001; PackageDocument: Mar-2001; PackageReference: 0603; Publisher: Altium Limited; Code_JEITA: 0603; Code_IPC: 1608 [0603]; ComponentLink1Description: Manufacturer Link; ComponentLink1URL: http://www.kemet.com/; ComponentLink2Description: Datasheet; ComponentLink2URL: http://www.kemet.com/kemet/web/homepage/kechome.nsf/vapubfilesname/F3102TA.pdf/$file/F3102TA.pdf
C29 = CDR01: Ceramic Chip Capacitor - MIL-PRF-55681; Published: 17-Jul-2002; LatestRevisionDate: 19-Mar-2004; LatestRevisionNote: Silkscreen size reduced.; DatasheetDocument: Mar-2001; PackageDocument: Mar-2001; PackageReference: C0805; Publisher: Altium Limited; Code_JEITA: 0805; Code_IPC: 2012[0805]; ComponentLink1Description: Manufacturer Link; ComponentLink1URL: http://www.kemet.com/; ComponentLink2Description: Datasheet; ComponentLink2URL: http://www.kemet.com/kemet/web/homepage/kechome.nsf/vapubfilesname/F3102TA.pdf/$file/F3102TA.pdf
D8 D9 = 15-21SURC/S530-A3/TR8 led smd 0805 red
D10 = 1N4148: High Conductance Fast Diode; Published: 8-Jun-2000; LatestRevisionDate: 17-Jul-2002; LatestRevisionNote: Re-released for DXP Platform.; DatasheetDocument: 1997; PackageReference: DO-35; Publisher: Altium Limited; Code_JEDEC: DO-204-AH; ComponentLink1Description: Manufacturer Link; ComponentLink1URL: http://www.fairchildsemi.com/; ComponentLink2Description: Datasheet; ComponentLink2URL: http://www.fairchildsemi.com/ds/1N%2F1N4148.pdf
J1 = Header 2: Header, 2-Pin; LatestRevisionDate: 17-Jul-2002; LatestRevisionNote: Re-released for DXP Platform.; Publisher: Altium Limited
P6 = XY2500R-F 3P: as P3 on sheet Regulators; Supplier 1: Digi-Key; Manufacturer Part Number: OSTOQ033250; Wire Strip Length: -; Termination Style: Solder; Mounting Type: Through Hole; Supplier: Digi-Key; Category: Connectors, Interconnects; Supplier Part Number: ED2820-ND; Voltage - IEC: -; Operating Temperature: -30°C ~ 105°C; Color: Green; Features: -; Ingress Protection: -; Wire Gauge or Range - mm²: -; Insulation Height: 0.362" (9.20mm); Wire Gauge or Range - AWG: -; Plug Wire Entry: -; Screw Size: -; Contact Mating Finish: Tin; Torque - Screw: -; Housing Material: Thermoplastic; Current - IEC: -; Contact Material: Brass; RoHS: RoHS Compliant; Part Status: Active; Packaging: Bulk; Type: Header, Male Pins, Shrouded (4 Side); Number of Positions: 3
P7 = Header 6: Header, 6-Pin; LatestRevisionDate: 17-Jul-2002; LatestRevisionNote: Re-released for DXP Platform.; Publisher: Altium Limited
P8 P9 P11 P13 = Header 3: Header, 3-Pin; LatestRevisionDate: 17-Jul-2002; LatestRevisionNote: Re-released for DXP Platform.; Publisher: Altium Limited
P10 = Header 5X2: Header, 5-Pin, Dual row; LatestRevisionDate: 17-Jul-2002; LatestRevisionNote: Re-released for DXP Platform.; Publisher: Altium Limited
R13 R14 = ERJ8BQ: as R7 on sheet Variable Output 1; Published: 17-Dec-2003; LatestRevisionDate: 19-Mar-2004; LatestRevisionNote: Silkscreen size reduced.; PackageDocument: Mar-2003; PackageReference: 8RB-1206; Publisher: Altium Limited; Code_IPC: 3216 [1206]; ComponentLink1Description: Manufacturer Link; ComponentLink1URL: http://www.panasonic.com/industrial/components/resistive_products.htm; ComponentLink2Description: Datasheet; ComponentLink2URL: http://www.panasonic.com/industrial/components/pdf/AOA0000CE3.pdf
R15 = ERA3Y: as R5 on sheet Regulators; Published: 17-Dec-2003; LatestRevisionDate: 19-Mar-2004; LatestRevisionNote: Silkscreen size reduced.; PackageDocument: Mar-2003; PackageReference: ERA-0603; Publisher: Altium Limited; Code_IPC: 1608 [0603]; ComponentLink1Description: Manufacturer Link; ComponentLink1URL: http://www.panasonic.com/industrial/components/resistive_products.htm; ComponentLink2Description: Datasheet; ComponentLink2URL: http://www.panasonic.com/industrial/components/pdf/AOA0000CE8.pdf
TP1 = Plug: LatestRevisionDate: 17-Jul-2002; LatestRevisionNote: Re-released for DXP Platform.; Publisher: Altium Limited
U7 = DSPIC33EP64GS502: dsPIC dsPIC™ 33EP Microcontroller IC 16-Bit 70 MIPs 64KB (64K x 8) FLASH 28-SOIC; Manufacturer: Microchip Technology; Number of I/O: 21; Peripherals: Brown-out Detect/Reset, POR, PWM, WDT; Oscillator Type: Internal; Speed: 70 MIPs; Voltage - Supply (Vcc/Vdd): 3 V ~ 3.6 V; Data Converters: A/D 12x12b, D/A 1x12b; Connectivity: I²C, IrDA, LIN, SPI, UART/USART; RAM Size: 8K x 8; Package / Case: 28-SOIC (0.295", 7.50mm Width); Supplier Device Package: 28-SOIC; Program Memory Size: 64KB (64K x 8); Operating Temperature: -40°C ~ 85°C (TA); Core Processor: dsPIC; Category: Integrated Circuits (ICs); Program Memory Type: FLASH; Core Size: 16-Bit; Packaging: Tube; EEPROM Size: -; RoHS: RoHS Compliant; Part Status: Active; Supplier: Digi-Key; Supplier Part Number: DSPIC33EP64GS502-I/SO-ND
U8 = MCP1501T: Series Voltage Reference IC ±0.08% 20mA SOT-23-6

## Sheet Remote Feedback.SchDoc
size A3
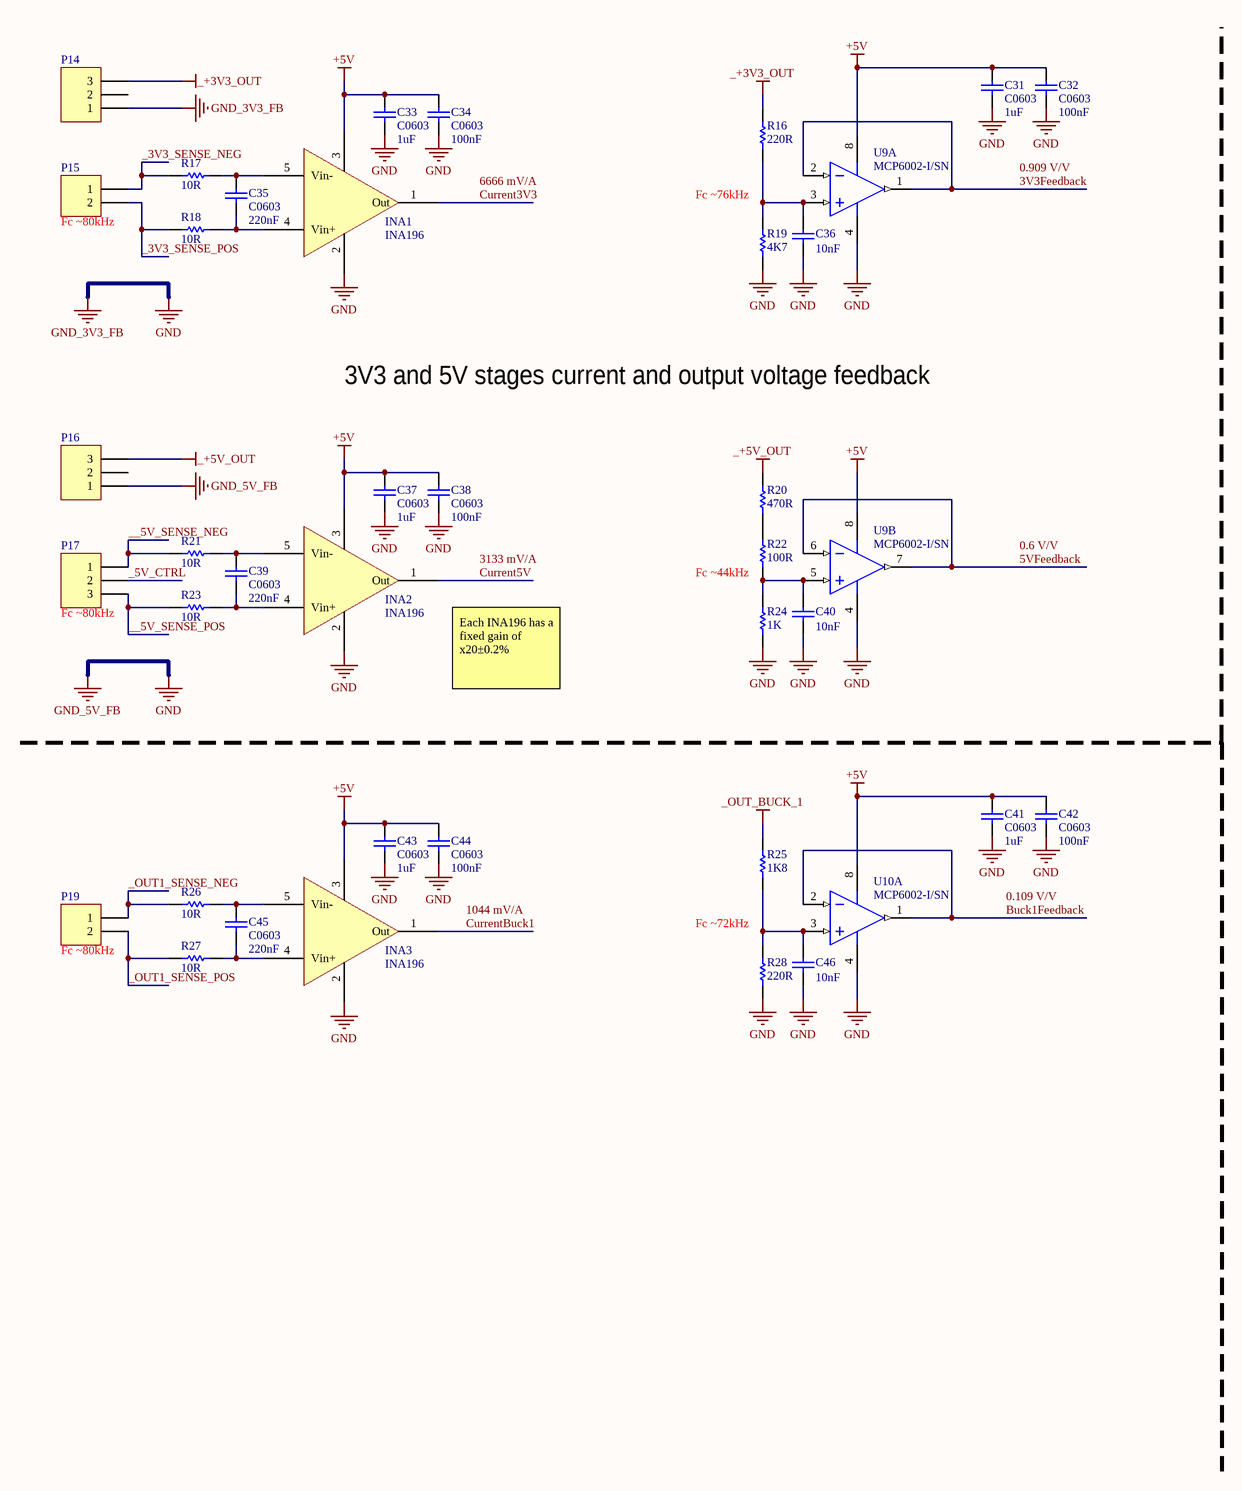
[diagram p4: Remote Feedback.SchDoc]

### Parts
C31  C0603  value 1uF  [0603]
C32  C0603  value 100nF  [0603]
C33  C0603  value 1uF  [0603]
C34  C0603  value 100nF  [0603]
C35  C0603  value 220nF  [0603]
C36  value 10nF  [C0805]  (hidden comment: CDR01)
C37  C0603  value 1uF  [0603]
C38  C0603  value 100nF  [0603]
C39  C0603  value 220nF  [0603]
C40  value 10nF  [C0805]  (hidden comment: CDR01)
C41  C0603  value 1uF  [0603]
C42  C0603  value 100nF  [0603]
C43  C0603  value 1uF  [0603]
C44  C0603  value 100nF  [0603]
C45  C0603  value 220nF  [0603]
C46  value 10nF  [C0805]  (hidden comment: CDR01)
INA1  INA196  [SOT-23-5]
INA2  INA196  [SOT-23-5]
INA3  INA196  [SOT-23-5]
P14  Header 3  [My_1X03]  (value not drawn)
P15  Header 2  [My_1X02]  (value not drawn)
P16  Header 3  [My_1X03]  (value not drawn)
P17  Header 3  [My_1X03]  (value not drawn)
P19  Header 2  [My_1X02]  (value not drawn)
R16  value 220R  [8RB-1206]  (hidden comment: SMD)
R17  10R  [ERA-0603]
R18  10R  [ERA-0603]
R19  value 4K7  [8RB-1206]  (hidden comment: SMD)
R20  value 470R  [8RB-1206]  (hidden comment: SMD)
R21  10R  [ERA-0603]
R22  value 100R  [8RB-1206]  (hidden comment: SMD)
R23  10R  [ERA-0603]
R24  value 1K  [8RB-1206]  (hidden comment: SMD)
R25  value 1K8  [8RB-1206]  (hidden comment: SMD)
R26  10R  [ERA-0603]
R27  10R  [ERA-0603]
R28  value 220R  [8RB-1206]  (hidden comment: SMD)
U9  MCP6002-I/SN  [SOIC-SN8_N]  (parts A,B of 2)
U10  MCP6002-I/SN  [SOIC-SN8_N]  (part A of 2)

### Nets
+5V: C31.2 C32.2 C33.2 C34.2 C37.2 C38.2 C41.2 C42.2 C43.2 C44.2 INA1.3 INA2.3 INA3.3 U9.8(VDD) U10.8(VDD)
_+3V3_OUT: P14.3 R16.2
_+5V_OUT: P16.3 R20.2
_OUT_BUCK_1: R25.2
GND: C31.1 C32.1 C33.1 C34.1 C36.1 C37.1 C38.1 C40.1 C41.1 C42.1 C43.1 C44.1 C46.1 INA1.2(GND) INA2.2(GND) INA3.2(GND) P14.1 P16.1 R19.1 R24.1 R28.1 U9.4(VSS) U10.4(VSS)  [also labelled GND_3V3_FB, GND_5V_FB]
3V3Feedback: U9.1(VOUTA) U9.2(VINA-)
5VFeedback: U9.6(VINB-) U9.7(VOUTB)
_3V3_SENSE_NEG: P15.1 R17.2
_3V3_SENSE_POS: P15.2 R18.2
_5V_CTRL: P17.2
__5V_SENSE_NEG: P17.1 R21.2
__5V_SENSE_POS: P17.3 R23.2
_OUT1_SENSE_NEG: P19.1 R26.2
_OUT1_SENSE_POS: P19.2 R27.2
Buck1Feedback: U10.1(VOUTA) U10.2(VINA-)
Current3V3: INA1.1(Out)
Current5V: INA2.1(Out)
CurrentBuck1: INA3.1(Out)
NetC35_1: C35.1 INA1.4(Vin+) R18.1
NetC35_2: C35.2 INA1.5(Vin-) R17.1
NetC36_2: C36.2 R16.1 R19.2 U9.3(VINA+)
NetC39_1: C39.1 INA2.4(Vin+) R23.1
NetC39_2: C39.2 INA2.5(Vin-) R21.1
NetC40_2: C40.2 R22.1 R24.2 U9.5(VINB+)
NetC45_1: C45.1 INA3.4(Vin+) R27.1
NetC45_2: C45.2 INA3.5(Vin-) R26.1
NetC46_2: C46.2 R25.1 R28.2 U10.3(VINA+)
NetR20_1: R20.1 R22.2

Not connected (* = marked no-connect by the designer): P14 2; P16 2

### Notes on the sheet
- (near P15) Fc ~80kHz
- Fc ~76kHz
- 3V3 and 5V stages current and output voltage feedback
- (near R22) Fc ~44kHz
- (near P17) Fc ~80kHz
- Each INA196 has a fixed gain of x20±0.2%
- (near P19) Fc ~80kHz
- Fc ~72kHz
- Labels drawn without touching a wire or pin: 0.6 V/V, 0.109 V/V, 0.909 V/V, 1044 mV/A, 3133 mV/A, 6666 mV/A

### Library data of the parts
C31-C35 C37-C39 C41-C45 = C0603: as C18 on sheet Regulators; Published: 17-Jul-2002; LatestRevisionDate: 19-Mar-2004; LatestRevisionNote: Silkscreen size reduced.; DatasheetDocument: Mar-2001; PackageDocument: Mar-2001; PackageReference: 0603; Publisher: Altium Limited; Code_JEITA: 0603; Code_IPC: 1608 [0603]; ComponentLink1Description: Manufacturer Link; ComponentLink1URL: http://www.kemet.com/; ComponentLink2Description: Datasheet; ComponentLink2URL: http://www.kemet.com/kemet/web/homepage/kechome.nsf/vapubfilesname/F3102TA.pdf/$file/F3102TA.pdf
C36 C40 C46 = CDR01: Ceramic Chip Capacitor - MIL-PRF-55681; Published: 17-Jul-2002; LatestRevisionDate: 19-Mar-2004; LatestRevisionNote: Silkscreen size reduced.; DatasheetDocument: Mar-2001; PackageDocument: Mar-2001; PackageReference: C0805; Publisher: Altium Limited; Code_JEITA: 0805; Code_IPC: 2012[0805]; ComponentLink1Description: Manufacturer Link; ComponentLink1URL: http://www.kemet.com/; ComponentLink2Description: Datasheet; ComponentLink2URL: http://www.kemet.com/kemet/web/homepage/kechome.nsf/vapubfilesname/F3102TA.pdf/$file/F3102TA.pdf
INA1-INA3 = INA196: Current Shunt Monitor −16 V to +80 V Common-Mode Range
P14 P16 P17 = Header 3: Header, 3-Pin; LatestRevisionDate: 17-Jul-2002; LatestRevisionNote: Re-released for DXP Platform.; Publisher: Altium Limited
P15 P19 = Header 2: Header, 2-Pin; LatestRevisionDate: 17-Jul-2002; LatestRevisionNote: Re-released for DXP Platform.; Publisher: Altium Limited
R16 R19 R20 R22 R24 R25 R28 = ERJ8BQ: as R7 on sheet Variable Output 1; Published: 17-Dec-2003; LatestRevisionDate: 19-Mar-2004; LatestRevisionNote: Silkscreen size reduced.; PackageDocument: Mar-2003; PackageReference: 8RB-1206; Publisher: Altium Limited; Code_IPC: 3216 [1206]; ComponentLink1Description: Manufacturer Link; ComponentLink1URL: http://www.panasonic.com/industrial/components/resistive_products.htm; ComponentLink2Description: Datasheet; ComponentLink2URL: http://www.panasonic.com/industrial/components/pdf/AOA0000CE3.pdf
R17 R18 R21 R23 R26 R27 = ERA3Y: as R5 on sheet Regulators; Published: 17-Dec-2003; LatestRevisionDate: 19-Mar-2004; LatestRevisionNote: Silkscreen size reduced.; PackageDocument: Mar-2003; PackageReference: ERA-0603; Publisher: Altium Limited; Code_IPC: 1608 [0603]; ComponentLink1Description: Manufacturer Link; ComponentLink1URL: http://www.panasonic.com/industrial/components/resistive_products.htm; ComponentLink2Description: Datasheet; ComponentLink2URL: http://www.panasonic.com/industrial/components/pdf/AOA0000CE8.pdf
U9 U10 = MCP6002-I/SN: 1 MHz, Low-Power Operational Amplifier, 8-Pin SOIC, Industrial Temperature; Manufacturer: Microchip; DatasheetVersion: revJ, Nov-2009; PackageVersion: revBB, Aug-2009; PackageReference: SOIC-SN8; PackageDescription: 8-Lead Plastic Small Outline (SN) - Narrow, 3.90mm Body [SOIC]; Supplier 1: Digi-Key; Supplier Part Number 1: MCP6002-I/SN-ND; Supplier 2: Farnell; Supplier Part Number 2: 1292246; Supplier 3: Newark; Supplier Part Number 3: 63K5672; Supplier 4: Mouser; Supplier Part Number 4: 579-MCP6002-I/SN; Mounting Technology: Surface Mount; Code_JEDEC: MS-012; Code_IPC: SOIC127P600-8; PartNumber: MCP6002-I/SN; ComponentLink1Description: Manufacturer URL; ComponentLink1URL: http://www.microchip.com/; ComponentLink2Description: Datasheet; ComponentLink2URL: http://ww1.microchip.com/downloads/en/DeviceDoc/21733j.pdf; ComponentLink3Description: Package Specification; ComponentLink3URL: http://www.microchip.com/stellent/groups/techpub_sg/documents/packagingspec/en012702.pdf

## Nets that join several sheets
+3V3: Regulators (C19.2 P3.1 U5.3), Control (9 pins)
+5V: Regulators (8 pins), Control (5 pins), Remote Feedback (15 pins)
+15V: Regulators (C18.2 U4.3), Variable Output 1 (C24.2 C25.2 D7.1 U6.1)
+30V: Regulators (9 pins), 5V and 3V3 Outputs (C5.1 Rref.2 U1.1), Variable Output 1 (Q1.2)
GND: Regulators (19 pins), 5V and 3V3 Outputs (17 pins), Variable Output 1 (13 pins), Control (21 pins), Remote Feedback (23 pins)
3V3Feedback: Control (U7.11), Remote Feedback (U9.1 U9.2)
5VFeedback: Control (U7.5), Remote Feedback (U9.6 U9.7)
_5V_CTRL: Control (U7.9), Remote Feedback (P17.2)
Buck1Feedback: Control (U7.3), Remote Feedback (U10.1 U10.2)
Current3V3: Control (U7.10), Remote Feedback (INA1.1)
Current5V: Control (U7.4), Remote Feedback (INA2.1)
CurrentBuck1: Control (U7.2), Remote Feedback (INA3.1)
Gate1_Buck1_PIC: Variable Output 1 (P4.1 U6.2), Control (P8.1 U7.26)
Gate2_Buck1_PIC: Variable Output 1 (P4.3 U6.3), Control (P8.3 U7.25)